# Altium schematic sheet ATmega4809_Curiosity_Nano_Debugger.SchDoc
size A3; SheetTitle: Debugger; CompanyName: Microchip Technology Inc.; Organization: Microchip Technology; Address1: 2355 West Chandler Blvd.; Address2: Chandler, AZ  85224; Address4: USA; SheetNumber: 3; SheetTotal: 4; Time: Time
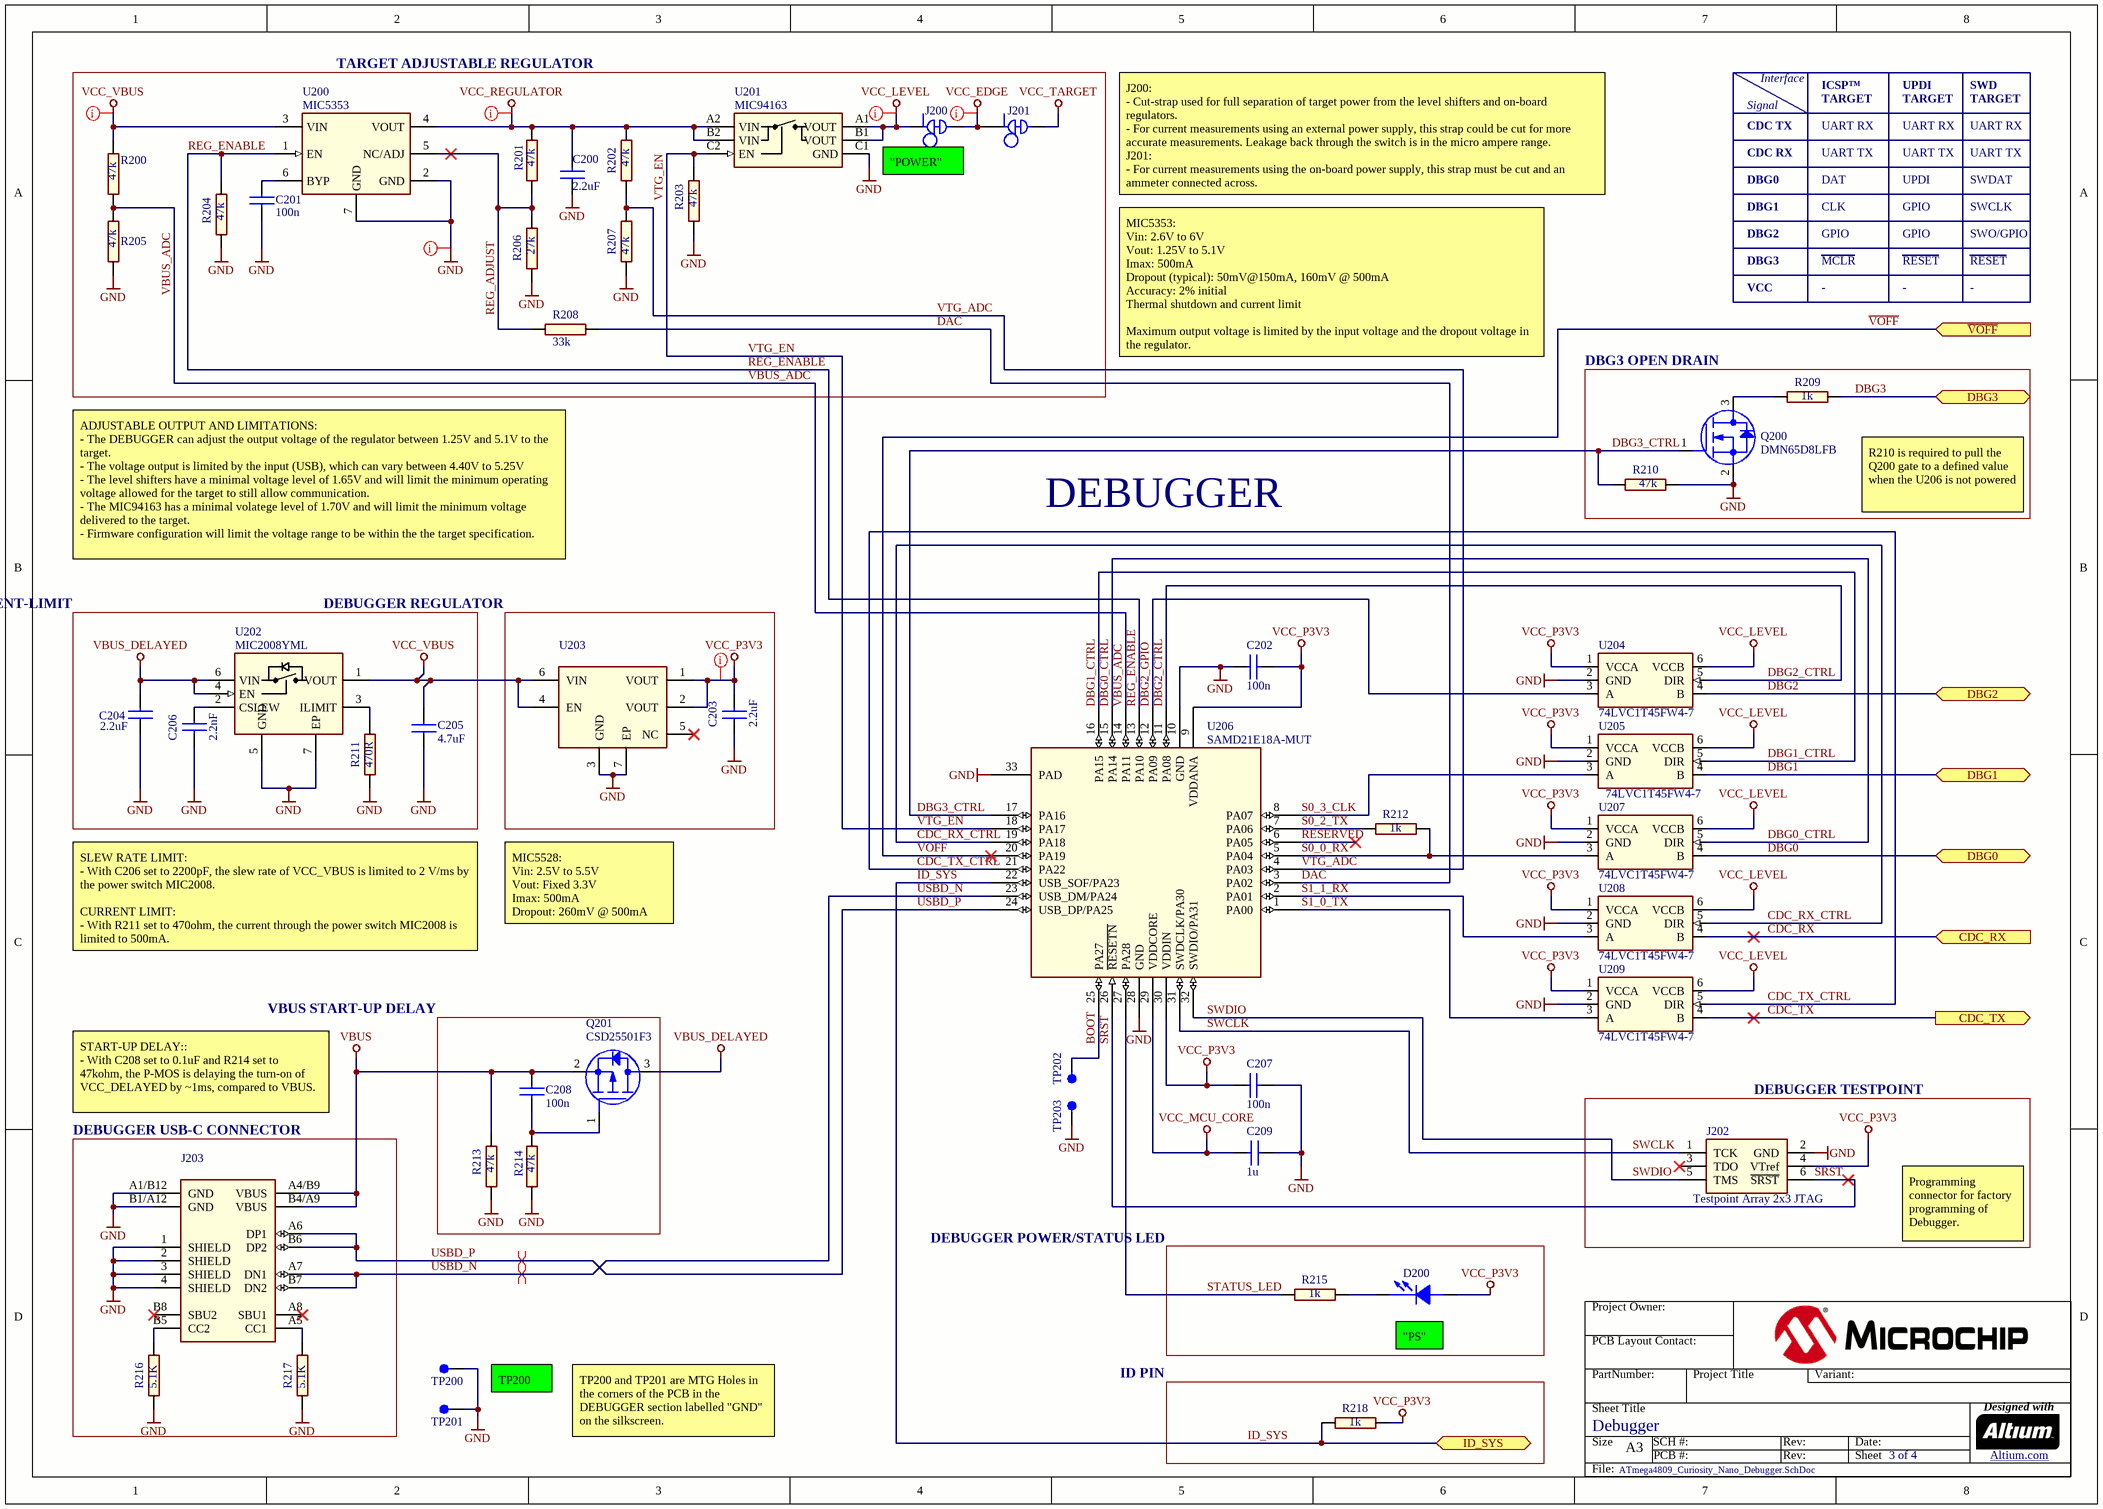
[diagram p0: ATmega4809_Curiosity_Nano_Debugger.SchDoc]

## Parts
C200  value 2.2uF  [AP1-00148]
C201  value 100n  [AP1-00148]
C202  value 100n  [AP1-00148]
C203  value 2.2uF  [AP1-00148]
C204  value 2.2uF  [AP1-00148]
C205  value 4.7uF  [AP1-00039]
C206  value 2.2nF  [AP1-00148]
C207  value 100n  [AP1-00148]
C208  value 100n  [AP1-00148]
C209  value 1u  [AP1-00148]
D200  (no value)  [AP4-00160]
J200  (no value)  [AP8-00595]  (net tie, no BOM)
J201  (no value)  [AP8-01183]  (net tie, no BOM)
J202  value Testpoint Array 2x3 JTAG  [AP8-01249]  (no BOM)
J203  (no value)  [AP8-01248]
Q200  value DMN65D8LFB  [AP5-00056]
Q201  value CSD25501F3  [AP5-00062]
R200  value 47k  [AP2-00108]
R201  value 47k  [AP2-00108]
R202  value 47k  [AP2-00108]
R203  value 47k  [AP2-00108]
R204  value 47k  [AP2-00108]
R205  value 47k  [AP2-00108]
R206  value 27k  [AP2-00108]
R207  value 47k  [AP2-00108]
R208  value 33k  [AP2-00108]
R209  value 1k  [AP2-00108]
R210  value 47k  [AP2-00108]
R211  value 470R  [AP2-00108]
R212  value 1k  [AP2-00108]
R213  value 47k  [AP2-00108]
R214  value 47k  [AP2-00108]
R215  value 1k  [AP2-00108]
R216  value 5.1K  [AP2-00108]
R217  value 5.1K  [AP2-00108]
R218  value 1k  [AP2-00108]
TP200  PCB implemented component.  [AP8-01250]  (value not drawn)  (no BOM)
TP201  PCB implemented component.  [AP8-01250]  (value not drawn)  (no BOM)
TP202  PCB implemented component.  [AP8-00870]  (value not drawn)  (no BOM)
TP203  PCB implemented component.  [AP8-00870]  (value not drawn)  (no BOM)
U200  value MIC5353  [AP6-00504]  (hidden comment: Marking code: AAR)
U201  value MIC94163  [AP6-00513]
U202  value MIC2008YML  [AP6-00576]
U203  (no value)  [AP6-00481]
U204  value 74LVC1T45FW4-7  [AP6-00575]
U205  value 74LVC1T45FW4-7  [AP6-00575]
U206  value SAMD21E18A-MUT  [AP6-00418]  (hidden comment: QFN32)
U207  value 74LVC1T45FW4-7  [AP6-00575]
U208  value 74LVC1T45FW4-7  [AP6-00575]
U209  value 74LVC1T45FW4-7  [AP6-00575]

## Blocks framed on the sheet
TARGET ADJUSTABLE REGULATOR: C200 C201 J200 J201 R200-R208 U200 U201
DBG3 OPEN DRAIN: Q200 R209 R210
VBUS SLEW RATE- & CURRENT-LIMIT: C204-C206 R211 U202
DEBUGGER REGULATOR: C203 U203
VBUS START-UP DELAY: C208 Q201 R213 R214
DEBUGGER TESTPOINT: J202
DEBUGGER USB-C CONNECTOR: J203 R216 R217
DEBUGGER POWER/STATUS LED: D200 R215
ID PIN: R218

## Ports
CDC_RX (in), CDC_TX (out), DBG0 (bidir), DBG1 (bidir), DBG2 (bidir), DBG3 (bidir), ID_SYS (bidir), ~{VOFF} (in)

## Nets
GND: C200.1 C201.2 C202.1 C203.1 C204.1 C205.1 C206.2 C207.2 C209.1 J202.2(GND) J203.1(SHIELD) J203.2(SHIELD) J203.3(SHIELD) J203.4(SHIELD) J203.A1/B12(GND) J203.B1/A12(GND) Q200.2(S) R203.2 R204.2 R205.1 R206.1 R207.1 R210.2 R211.2 R213.2 R214.2 R216.2 R217.2 TP200.1 TP201.1 TP203.1 U200.2(GND) U200.7(GND) U201.C1(GND) U202.5(GND) U202.7(EP) U203.3(GND) U203.7(EP) U204.2(GND) U205.2(GND) U206.10(GND) U206.28(GND) U206.33(PAD) U207.2(GND) U208.2(GND) U209.2(GND)
VBUS: C208.1 J203.A4/B9(VBUS) J203.B4/A9(VBUS) Q201.2(S) R213.1
VBUS_DELAYED: C204.2 Q201.3(D) U202.4(EN) U202.6(VIN)
VCC_EDGE: J200.2 J201.1
VCC_LEVEL: J200.1 U201.A1(VOUT) U201.B1(VOUT) U204.6(VCCB) U205.6(VCCB) U207.6(VCCB) U208.6(VCCB) U209.6(VCCB)
VCC_MCU_CORE: C209.2 U206.29(VDDCORE)
VCC_P3V3: C202.2 C203.2 C207.1 D200.2(ANODE) J202.4(VTref) R218.2 U203.1(VOUT) U203.2(VOUT) U204.1(VCCA) U205.1(VCCA) U206.9(VDDANA) U206.30(VDDIN) U207.1(VCCA) U208.1(VCCA) U209.1(VCCA)
VCC_REGULATOR: C200.2 R201.1 R202.2 U200.4(VOUT) U201.A2(VIN) U201.B2(VIN)
VCC_TARGET: J201.2
VCC_VBUS: C205.2 R200.1 U200.3(VIN) U202.1(VOUT) U203.4(EN) U203.6(VIN)
BOOT: TP202.1 U206.25(PA27)
CDC_RX: U208.4(B) ; port CDC_RX
CDC_RX_CTRL: U206.19(PA18) U208.5(DIR)
CDC_TX: U209.4(B) ; port CDC_TX
CDC_TX_CTRL: U206.21(PA22) U209.5(DIR)
DAC: R208.2 U206.3(PA02)
DBG0: U207.4(B) ; port DBG0
DBG0_CTRL: U206.15(PA14) U207.5(DIR)
DBG1: U205.4(B) ; port DBG1
DBG1_CTRL: U205.5(DIR) U206.16(PA15)
DBG2: U204.4(B) ; port DBG2
DBG2_CTRL: U204.5(DIR) U206.11(PA08)
DBG2_GPIO: U204.3(A) U206.12(PA09)
DBG3: R209.2 ; port DBG3
DBG3_CTRL: Q200.1(G) R210.1 U206.17(PA16)
ID_SYS: R218.1 U206.22(USB_SOF/PA23) ; port ID_SYS
REG_ADJUST: R201.2 R206.2 R208.1 U200.5(NC/ADJ)
REG_ENABLE: R204.1 U200.1(EN) U206.13(PA10)
RESERVED: U206.6(PA05)
S0_0_RX: R212.1 U206.5(PA04) U207.3(A)
S0_2_TX: R212.2 U206.7(PA06)
S0_3_CLK: U205.3(A) U206.8(PA07)
S1_0_TX: U206.1(PA00) U209.3(A)
S1_1_RX: U206.2(PA01) U208.3(A)
~{SRST}: J202.6(~{SRST}) U206.26(~{RESETN})
STATUS_LED: R215.2 U206.27(PA28)
SWCLK: J202.1(TCK) U206.31(SWDCLK/PA30)
SWDIO: J202.5(TMS) U206.32(SWDIO/PA31)
USBD_N: J203.A7(DN1) J203.B7(DN2) U206.23(USB_DM/PA24)
USBD_P: J203.A6(DP1) J203.B6(DP2) U206.24(USB_DP/PA25)
~{VOFF}: U206.20(PA19) ; port ~{VOFF}
VBUS_ADC: R200.2 R205.2 U206.14(PA11)
VTG_ADC: R202.1 R207.2 U206.4(PA03)
VTG_EN: R203.1 U201.C2(EN) U206.18(PA17)
NetC201_1: C201.1 U200.6(BYP)
NetC206_1: C206.1 U202.2(CSLEW)
NetC208_2: C208.2 Q201.1(G) R214.1
NetD200_1: D200.1(CATHODE) R215.1
NetJ203_A5: J203.A5(CC1) R217.1
NetJ203_B5: J203.B5(CC2) R216.1
NetQ200_3: Q200.3(D) R209.1
NetR211_1: R211.1 U202.3(ILIMIT)

Not connected (* = marked no-connect by the designer): J202 3(TDO)*; J203 A8(SBU1)* B8(SBU2)*; U203 5(NC)*

## Layout directives
net class Power: GND, VCC_EDGE, VCC_LEVEL, VCC_P3V3, VCC_REGULATOR, VCC_VBUS
differential pair: USBD_N, USBD_P

## Notes on the sheet
- Signal
- Interface
- ICSP™
- TARGET
- UPDI
- SWD
- (near J200) "POWER"
- CDC TX
- CDC RX
- DBG0
- UART RX
- UART TX
- DAT
- SWDAT
- J200:
  - Cut-strap used for full separation of target power from the level shifters and on-board regulators.
  - For current measurements using an external power supply, this strap could be cut for more accurate measurements. Leakage back through the switch is in the micro ampere range.
  J201:
  - For current measurements using the on-board power supply, this strap must be cut and an ammeter connected across.
- DBG1
- DBG2
- CLK
- GPIO
- SWCLK
- SWO/GPIO
- DBG3
- VCC
- MCLR
- -
- RESET
- MIC5353:
  Vin: 2.6V to 6V
  Vout: 1.25V to 5.1V
  Imax: 500mA
  Dropout (typical): 50mV@150mA, 160mV @ 500mA
  Accuracy: 2% initial
  Thermal shutdown and current limit
  Maximum output voltage is limited by the input voltage and the dropout voltage in the regulator.
  (Vmax = Vin - dropout)
- DEBUGGER
- (near R209) R210 is required to pull the Q200 gate to a defined value when the U206 is not powered
- ADJUSTABLE OUTPUT AND LIMITATIONS:
  - The DEBUGGER can adjust the output voltage of the regulator between 1.25V and 5.1V to the target.
  - The voltage output is limited by the input (USB), which can vary between 4.40V to 5.25V
  - The level shifters have a minimal voltage level of 1.65V and will limit the minimum operating voltage allowed for the target to still allow communication.
  - The MIC94163 has a minimal volatege level of 1.70V and will limit the minimum voltage delivered to the target.
  - Firmware configuration will limit the voltage range to be within the the target specification.
- MIC5528:
  Vin: 2.5V to 5.5V
  Vout: Fixed 3.3V
  Imax: 500mA
  Dropout: 260mV @ 500mA
- SLEW RATE LIMIT:
  - With C206 set to 2200pF, the slew rate of VCC_VBUS is limited to 2 V/ms by the power switch MIC2008.
  CURRENT LIMIT:
  - With R211 set to 470ohm, the current through the power switch MIC2008 is limited to 500mA.
- START-UP DELAY::
  - With C208 set to 0.1uF and R214 set to 47kohm, the P-MOS is delaying the turn-on of VCC_DELAYED by ~1ms, compared to VBUS.
- Programming connector for factory programming of Debugger.
- TP200 and TP201 are MTG Holes in the corners of the PCB in the DEBUGGER section labelled "GND" on the silkscreen.
- (near D200) "PS"
- Project Owner:
- PCB Layout Contact:
- PartNumber:
- Project Title
- Variant:
- Sheet Title
- Size
- A3
- SCH #:
- PCB #:
- Rev:
- Date:
- Sheet
- Designed with
- Altium.com <http://go.altium.com/MicrochipLandingPage_Evaluation.html>
- File:

## Library data of the parts
C200 C203 C204 = A01-0493: CAP CER 2.2UF 10V 10% X5R 0402; PartGroup: Capacitors,Ceramic,SMD 0402; Manufacturer: TDK; MPN: C1005X5R1A225K050BC; Tolerance: +/-10%; TemperatureRange: -55 to 85C; AN: A01-0493; Height: 0.5
C201 C202 C207 C208 = A01-0246: Ceramic capacitor, SMD 0402, X7R, 16V, +/-10%; PartGroup: Capacitors,Ceramic,SMD 0402; Manufacturer: Yageo; MPN: CC0402KRX7R7BB104; TemperatureRange: -55 - +125 deg C; Tolerance: 16V, +/-10%; AN: A01-0246; Height: 0.5
C205 = A01-0377: Ceramic capacitor, SMD 0603, X5R, 10V, 10% (de31036); PartGroup: Capacitors,Ceramic,SMD 0603; Manufacturer: Yageo; MPN: CC0603KRX5R6BB475; TemperatureRange: -55 - +85 deg C; Tolerance: 10%; AN: A01-0377; Height: 0.800000011920929
C206 = A01-0918: Ceramic capacitor, SMD 0402, C0G, 25V, +/-5%; PartGroup: Capacitors,Ceramic,SMD 0402; Manufacturer: Kemet; MPN: C0402C222J3GACTU; TemperatureRange: -55C to +125C; Tolerance: 25V, +/-5%; AN: A01-0918; Height: 0.5
C209 = A01-0286: Ceramic capacitor, SMD 0402, X5R, 6.3V, +/-10% (de26942); PartGroup: Capacitors,Ceramic,SMD 0402; Manufacturer: Kemet; MPN: C0402C105K9PAC; TemperatureRange: -55 to 85 deg C; Tolerance: +/-10%; AN: A01-0286; Height: 0.5
D200 = A10-0213: LED, SMD 0402, Green, Wave length=569nm, 2.1mcd @ (1mA, 1.9Vf)rohm; PartGroup: Opto,LEDs,SMD; MPN: SML-P12MTT86R; Value: GREEN LED; TemperatureRange: -40 to +85; AN: A10-0213; Height: 0.200000002980232; Manufacturer: ROHM
J200 = A08-1454: Closed Link 0402; PartGroup: Mechanical devices,PCB implemented components; Value: Closed Link; AN: A08-1454
J201 = A08-3029: Closed Link with w/hole for 1x2 100mil header; PartGroup: Mechanical devices,PCB implemented components; Value: Closed Link 1x2 100mil header; AN: A08-3029
J202 = A08-3186: 6-pin Testpoint Array, 0.8mm Pad, 1.27mm Pitch; PartGroup: Mechanical devices,PCB implemented components,PCB plane connectors; AN: A08-3186; Height: 0
J203 = A08-3185: USB2.0 Type-C, Surface mount signals and DIP shield; PartGroup: Mechanical devices,Connectors,USB; Manufacturer: Cabcon A/S; Value: L-KLS1-5409-R; TemperatureRange: -30 to 85C; AN: A08-3185; Height: 3.16000008583069; MPN: L-KLS1-5409-R
Q200 = A05-0180: N-channel MOSFET, DFN1006-3 (SOT883), 60V, 330mA, 4Ohm; PartGroup: Transistors,Small signal FET,SMD; Manufacturer: Diodes Incorporated; MPN: DMN65D8LFB-7; TemperatureRange: -55Â°C to +150Â°C; AN: A05-0180
Q201 = A05-0209: P-Channel MOSFET, LGA, 20V, 3.6A, 76mOhm; PartGroup: Transistors,Small signal FET,SMD; Manufacturer: Texas Instruments; TemperatureRange: -55 to 150C; AN: A05-0209; Height: 0.200000002980232; MPN: CSD25501F3
R200-R205 R207 R210 R213 R214 = A02-0252: Thick film resistor, SMD 0402, 1/16W, 1%; PartGroup: Resistors,SMD,0402 1%; Manufacturer: KOA; MPN: RK73H1ETTP4702F; TemperatureRange: -55 - +125 deg C; Tolerance: 1 %; AN: A02-0252; Height: 0.349999994039536
R206 = A02-0246: Thick film resistor, SMD 0402, 1/16W, 1%; PartGroup: Resistors,SMD,0402 1%; Manufacturer: Yageo; MPN: RC0402FR-0727KL; TemperatureRange: -55 - +125 deg C; Tolerance: 1 %; AN: A02-0246; Height: 0.349999994039536
R208 = A02-0248: Thick film resistor, SMD 0402, 1/16W, 1%; PartGroup: Resistors,SMD,0402 1%; Manufacturer: Yageo; MPN: RC0402FR-0733KL; TemperatureRange: -55 - +125 deg C; Tolerance: 1 %; AN: A02-0248; Height: 0.349999994039536
R209 R212 R215 R218 = A02-0212: Thick film resistor, SMD 0402, 1/16W, 1%; PartGroup: Resistors,SMD,0402 1%; Manufacturer: Yageo; MPN: RC0402FR071KL; TemperatureRange: -55 - +125 deg C; Tolerance: 1 %; AN: A02-0212; Height: 0.349999994039536
R211 = A02-0946: Thick film resistror, SMD 0402, 1/16W, 1%; PartGroup: Resistors,SMD,0402 1%; Manufacturer: Yageo; MPN: RC0402FR-07470RL; TemperatureRange: â€“55 to +155 deg C; Tolerance: 1%; AN: A02-0946; Height: 0.349999994039536
R216 R217 = A02-1244: Thick film resistor, SMD 0402, 1W, 1%; PartGroup: Resistors,SMD,0402 1%; Manufacturer: Panasonic; MPN: ERJ-2RKF5101X; TemperatureRange: -55C to +125C; Tolerance: 1%; AN: A02-1244; Height: 0.349999994039536
TP200 TP201 = A08-3187: TH Test point - D3.6H2.7; PartGroup: Mechanical devices,Connectors,Test points; Value: TH Test point - D3.6H2.7; AN: A08-3187; Height: 0
TP202 TP203 = A08-2176: SMD Test point - 0.8mm; PartGroup: Mechanical devices,Connectors,Test points; Value: SMD Test point - 0.8mm; AN: A08-2176; Height: 0
U200 = A06-1578: 500mA Ultra Low Dropout LDO regulator, 2% accuracy, 1.6x1.6mm MLF; PartGroup: Integrated Circuits,Regulators,Linear; Manufacturer: Microchip; MPN: MIC5353YMT-TR; TemperatureRange: -40Â°C to +125Â°C; AN: A06-1578; Height: 0.899999976158142
U201 = A06-1613: Loadswitch, Rds(on) = 14.5mohm, 1.0mm x 1.5mm WLCSP, reverse blocking; PartGroup: Integrated Circuits,General linear,Analog switch, bus switch and MUX; Manufacturer: Microchip; MPN: MIC94163YCS-TR; TemperatureRange: -40Â°C to +125Â°C; AN: A06-1613; Height: 0.800000011920929
U202 = A06-1826: 0.2A- 2.5A adjustable current limit power switch, 2mm x 2mm DFN; PartGroup: Integrated Circuits,General linear,Analog switch, bus switch and MUX; Manufacturer: Microchip; MPN: MIC2008YML-TR; TemperatureRange: -40C to +85C; AN: A06-1826; Height: 0.850000023841858
U203 = A06-1475: LDO 3.3V 0.5A 6TDFN; PartGroup: Integrated Circuits,Regulators,Linear; Manufacturer: Microchip; MPN: MIC5528-3.3YMT-T5; Value: MIC5528-3.3YMT; TemperatureRange: -40Â°C ~ 125Â°C; AN: A06-1475; Design Comment: *; Height: 0.550000011920929
U204 U205 U207-U209 = A06-1580: Single-Bit Dual-Supply Transceive, 1.65-5.5 Translation and 3-State Outputs; PartGroup: Integrated Circuits,Interface ICs,Level translators; Manufacturer: Diodes Incorporated; TemperatureRange: -40C - 125C; AN: A06-1580; Height: 0.400000005960464; MPN: 74LVC1T45FW4-7
U206 = A06-1205: 32-bit RISC MCU 32pin; PartGroup: Integrated Circuits,MCU, MPU, DSP,ARM MCU; Manufacturer: Microchip; MPN: ATSAMD21E18A-MUT; TemperatureRange: -40Â°C to +85Â°C; AN: A06-1205; Height: 1.20000004768372